# EAGLE design DAQAccel (EAGLE 9.6.0)
DOCUMENT_NUMBER: tbd; DOCUMENT_REVISION: ( ); RELEASE_DATE: tbd
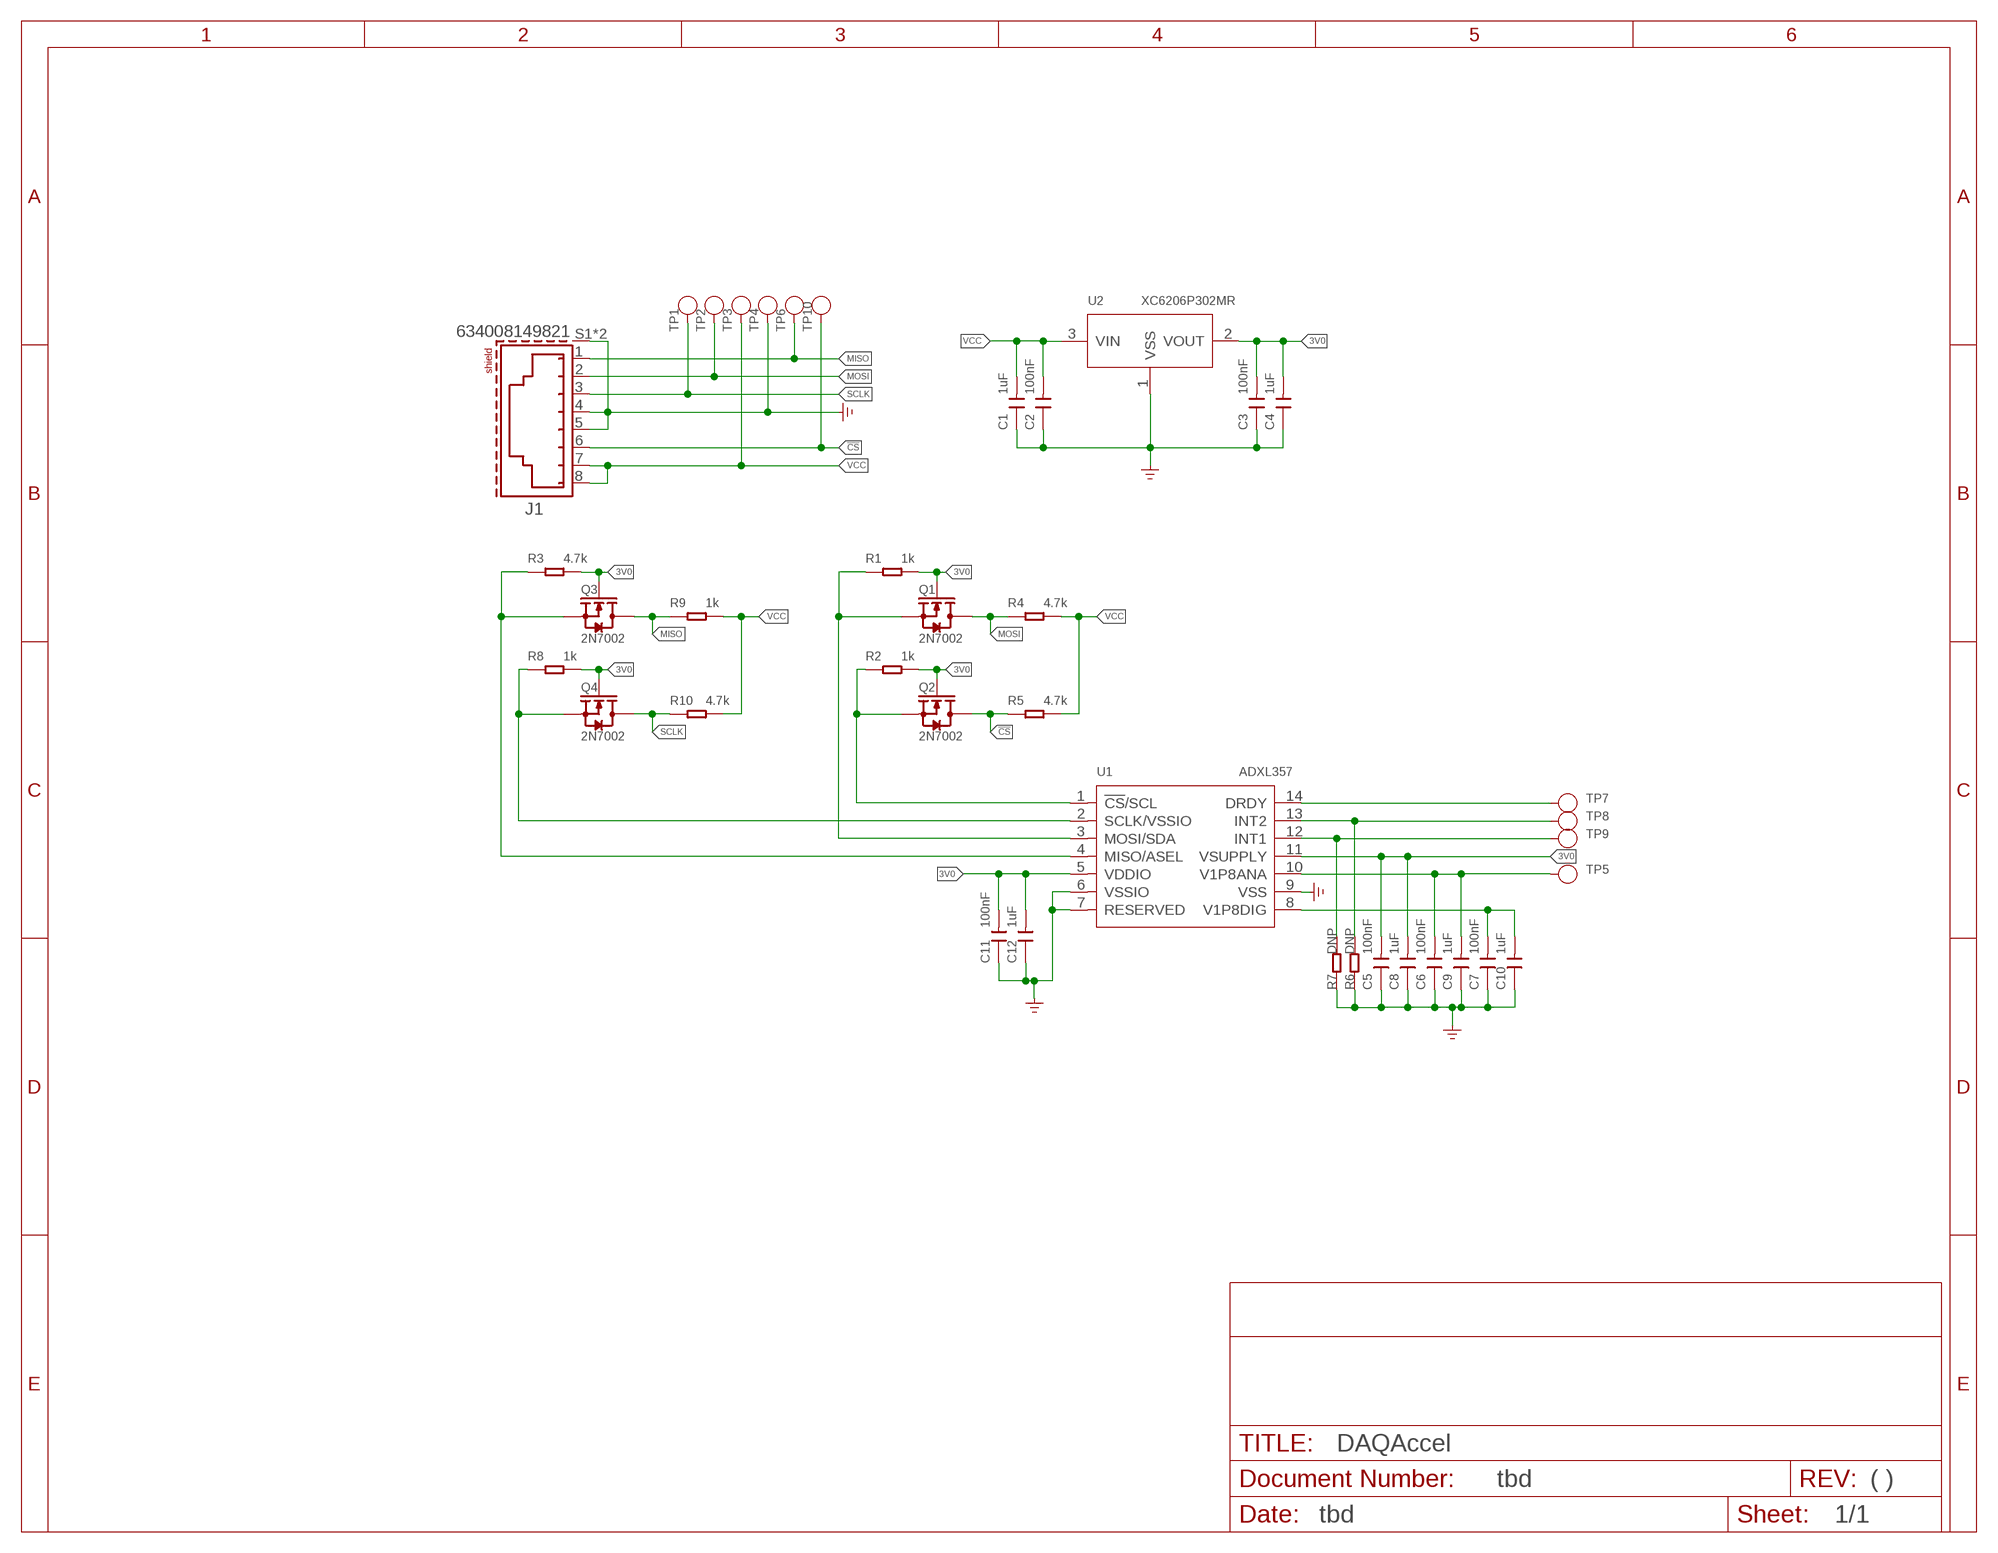
[diagram p0: schematic, sheet 1]

## Parts
C1  1uF  CAP-0603  [C0603]
C2  100nF  CAP-0603  [C0603]
C3  100nF  CAP-0603  [C0603]
C4  1uF  CAP-0603  [C0603]
C5  100nF  CAP-0603  [C0603]
C6  100nF  CAP-0603  [C0603]
C7  100nF  CAP-0603  [C0603]
C8  1uF  CAP-0603  [C0603]
C9  1uF  CAP-0603  [C0603]
C10  1uF  CAP-0603  [C0603]
C11  100nF  CAP-0603  [C0603]
C12  1uF  CAP-0603  [C0603]
J1  634008149821  [634008149821]
Q1  2N7002  MOSFET-N'SOT23'  [SOT-23]
Q2  2N7002  MOSFET-N'SOT23'  [SOT-23]
Q3  2N7002  MOSFET-N'SOT23'  [SOT-23]
Q4  2N7002  MOSFET-N'SOT23'  [SOT-23]
R1  1k  RES-0603  [R0603]
R2  1k  RES-0603  [R0603]
R3  4.7k  RES-0603  [R0603]
R4  4.7k  RES-0603  [R0603]
R5  4.7k  RES-0603  [R0603]
R6  DNP  RES-0603  [R0603]
R7  DNP  RES-0603  [R0603]
R8  1k  RES-0603  [R0603]
R9  1k  RES-0603  [R0603]
R10  4.7k  RES-0603  [R0603]
TP1  Test  TEST-POINT'4545'  [TP-D45MIL]
TP2  Test  TEST-POINT'4545'  [TP-D45MIL]
TP3  Test  TEST-POINT'4545'  [TP-D45MIL]
TP4  Test  TEST-POINT'4545'  [TP-D45MIL]
TP5  Test  TEST-POINT'4545'  [TP-D45MIL]
TP6  Test  TEST-POINT'4545'  [TP-D45MIL]
TP7  Test  TEST-POINT'4545'  [TP-D45MIL]
TP8  Test  TEST-POINT'4545'  [TP-D45MIL]
TP9  Test  TEST-POINT'4545'  [TP-D45MIL]
TP10  Test  TEST-POINT'4545'  [TP-D45MIL]
U1  ADXL357  SENSOR-ADXL357BEZ  [LCC-14-TERMINAL]
U2  XC6206P302MR  PMIC-XC6206PMR  [SOT-23]

## Nets
3V0: C3.2 C4.2 C5.2 C8.2 C11.2 C12.2 Q1.1(G) Q2.1(G) Q3.1(G) Q4.1(G) R1.2 R2.2 R3.2 R8.2 U1.5(VDDIO) U1.11(VSUPPLY) U2.2(VOUT)
!CS: J1.6 Q2.3(D) R5.1 TP10.T
GND: C1.1 C2.1 C3.1 C4.1 C5.1 C6.1 C7.1 C8.1 C9.1 C10.1 C11.1 C12.1 J1.4 J1.5 J1.S1(SHIELD) J1.S2(SHIELD) R6.1 R7.1 TP4.T U1.6(VSSIO) U1.7(RESERVED) U1.9(VSS) U2.1(VSS) ; supply symbol labelled GND_POWER
MISO: J1.1 Q3.3(D) R9.1 TP6.T
MOSI: J1.2 Q1.3(D) R4.1 TP2.T
N$1: Q2.2(S) R2.1 U1.1(!CS!/SCL)
N$2: TP7.T U1.14(DRDY)
N$3: Q1.2(S) R1.1 U1.3(MOSI/SDA)
N$4: R6.2 TP8.T U1.13(INT2)
N$5: C6.2 C9.2 TP5.T U1.10(V1P8ANA)
N$6: Q4.2(S) R8.1 U1.2(SCLK/VSSIO)
N$7: C7.2 C10.2 U1.8(V1P8DIG)
N$8: R7.2 TP9.T U1.12(INT1)
N$9: Q3.2(S) R3.1 U1.4(MISO/ASEL)
SCLK: J1.3 Q4.3(D) R10.1 TP1.T
VCC: C1.2 C2.2 J1.7 J1.8 R4.2 R5.2 R9.2 R10.2 TP3.T U2.3(VIN)

## Library data of the parts
C1-C12 = Discrete-new:CAP: Ceramic Capacitors
J1 = WR-MJ:634008149821: WR-MJ Modular Jack Horizontal Shielded SMT 8P8C Tab Up KIND PROPERTIES Quality Class:500 Mating cycles General Information Operating Temperature:-40 up to +85 °C Compliance:RoHS Electrical Properties IR1:1.5A Working Voltage:120V (AC) Withstanding Voltage:1000V (AC) Contact Resistance:20mΩ RISO:500 MΩ Material Properties Insulator MateriaL:PA9T Insulator Flammability Rating:UL94 V-0 Color:Black Cover Material Brass Cover Plating Nickel Contact Material Copper Alloy Contact Plating:Selective Gold Contact Type:Stamped Shielding Material:Brass Shielding Plating:Nickel Packaging Properties Packaging:Tray <https://www.we-online.com/catalog/media/o60696v209%20Family_WR-MJ_Horizontal_Shielded_634008149821_pf2.jpg> Details see: https://www.we-online.com/catalog/en/MJ_SMT_HORIZONTAL_SHIELDED_8P8C_TAB_UP/ Updated by Yingchun,Shan 2019-11-26 2019 (C) Würth Elektronik; DATASHEET-URL: https://www.we-online.com/catalog/datasheet/634008149821.pdf; MOUNT: SMT; PART-NUMBER: 634008149821; TYPE: Horizontal; XPXC: 8P8C
Q1-Q4 = Discrete-new:MOSFET-N: IRLL014: http://www.vishay.com/docs/91319/sihll014.pdf
R1-R10 = Discrete-new:RES
TP1-TP10 = Discrete-new:TEST-POINT; PARTNO: DNP
U1 = Sensor:SENSOR-ADXL357BEZ
U2 = IC-new:PMIC-XC6206P: LOW ESR Cap.Compatible Positive Voltage Regulators

## Board
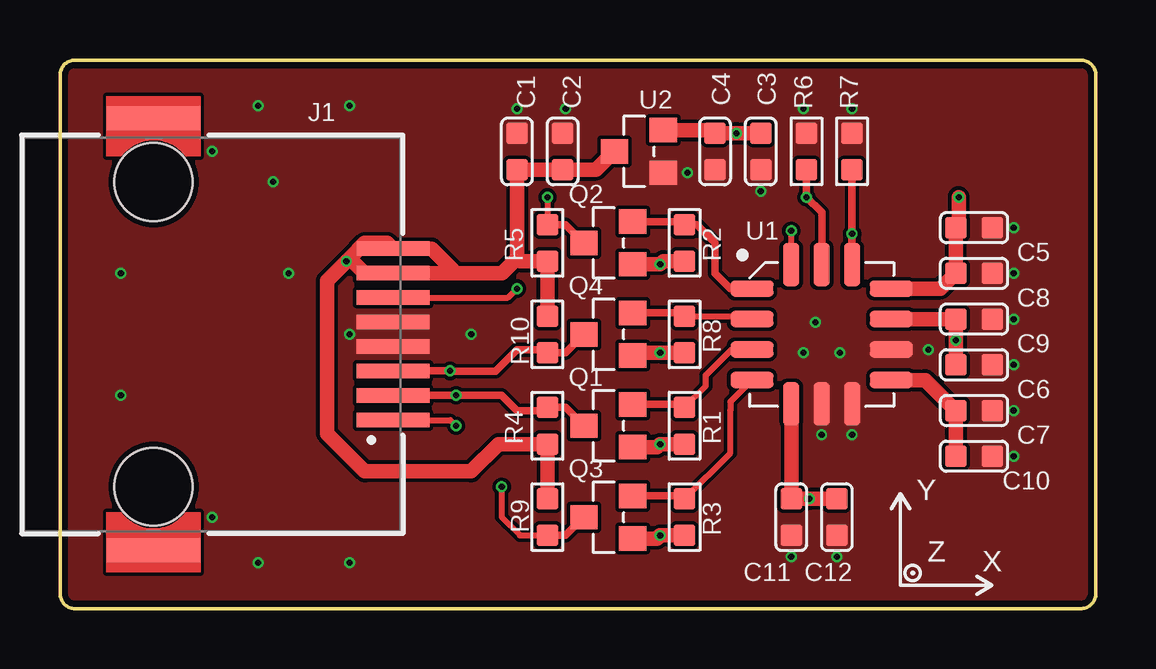
[diagram p1: board, top side]
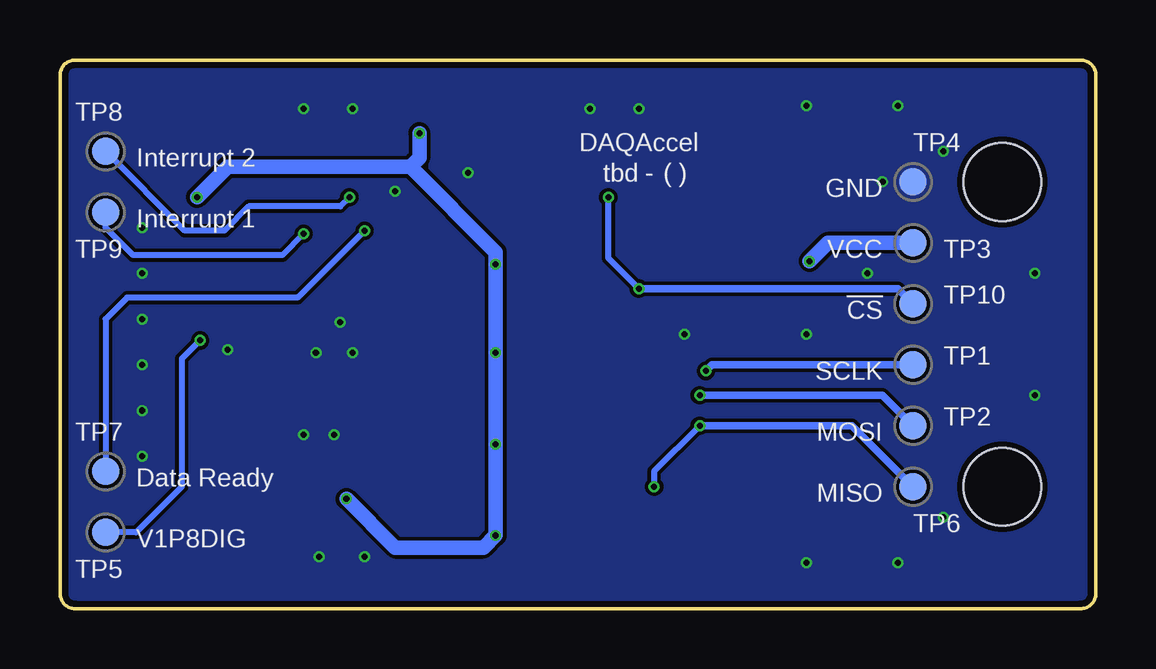
[diagram p2: board, bottom side, seen from below]

Size 43.18 x 22.86 mm. Coordinates in mm from the lower left corner, seen from the top.
Outline: 0.64,22.86 42.55,22.86 arc-90 43.18,22.23 43.18,0.63 arc-90 42.55,0 0.64,0 arc-90 0,0.63 0,22.23 arc-90 0.64,22.86
Copper layers (1*16): Top 0.035mm / dielectric 1.5mm / Bottom 0.035mm
Design rules "default *": minimum track width 1mil, minimum drill 10mil, track to track 6mil, track to pad 6mil, pad to pad 6mil, via to via 6mil, smd to smd 0mil, copper to edge 10mil, drill to drill 10mil, minimum pad ring 4mil, minimum via ring 4mil, stop-mask expansion 2mil, vias tented up to drill 25mil, thermal gap 10mil

### Footprints (pad centres in the part's own frame; a part is rotated, then mirrored left to right if it is on the bottom)
C0603 = smd 0.889 x 0.889: 1 -0.762,0; 2 0.762,0
634008149821 = smd 0.61 x 3.05: 1 3.57,7.53; 2 2.55,7.53; 3 1.53,7.53; 4 0.51,7.53; 5 -0.51,7.53; 6 -1.53,7.53; 7 -2.55,7.53; 8 -3.57,7.53 | smd 1 x 3.89: S1 -9,-2.45; S2 9,-2.45 | hole 3.25: -6.35,-2.45; 6.35,-2.45
SOT-23 = smd 1.143 x 1.016: 1 1.016,-0.889; 2 1.016,0.889; 3 -1.016,0
R0603 = smd 0.889 x 0.889: 1 -0.762,0; 2 0.762,0
TP-D45MIL = smd 1.143 x 1.143: T 0,0
LCC-14-TERMINAL = smd 0.68 x 1.8: 1 -1.905,-2.9; 2 -0.635,-2.9; 3 0.635,-2.9; 4 1.905,-2.9; 8 1.905,2.9; 9 0.635,2.9; 10 -0.635,2.9; 11 -1.905,2.9 | smd 1.8 x 0.68: 5 2.9,-1.27; 6 2.9,0; 7 2.9,1.27; 12 -2.9,1.27; 13 -2.9,0; 14 -2.9,-1.27
SOT-23' = smd 1.016 x 1.143: 1 -0.889,-1.016; 2 0.889,-1.016; 3 0,1.016

### Placement (x,y rotation side)
C1  19.05,19.05 270 top
C2  20.95,19.05 270 top
C3  29.21,19.05 90 top
C4  27.3,19.05 90 top
C5  38.1,15.88 180 top
C6  38.1,10.16 180 top
C7  38.1,8.25 180 top
C8  38.1,13.97 180 top
C9  38.1,12.06 180 top
C10  38.1,6.35 180 top
C11  30.48,3.81 90 top
C12  32.38,3.81 90 top
J1  6.35,11.43 270 top
Q1  22.86,7.62 0 top
Q2  22.86,15.24 0 top
Q3  22.86,3.81 0 top
Q4  22.86,11.43 0 top
R1  26.04,7.62 270 top
R2  26.04,15.24 270 top
R3  26.04,3.81 270 top
R4  20.32,7.62 270 top
R5  20.32,15.24 270 top
R6  31.12,19.05 270 top
R7  33.02,19.05 270 top
R8  26.04,11.43 270 top
R9  20.32,3.81 90 top
R10  20.32,11.43 90 top
TP1  7.62,10.16 0 bottom
TP2  7.62,7.62 0 bottom
TP3  7.62,15.24 0 bottom
TP4  7.62,17.78 0 bottom
TP5  41.27,3.17 0 bottom
TP6  7.62,5.08 0 bottom
TP7  41.27,5.71 0 bottom
TP8  41.27,19.05 0 bottom
TP9  41.27,16.51 0 bottom
TP10  7.62,12.7 0 bottom
U1  31.75,11.43 270 top
U2  XC6206P302MR  [SOT-23']  24.13,19.05 90 top

### Tracks (layer width: path | path; a pad name or v marks a point on that pad's centre or on a via)
3V0  (via drill 0.25)
  Top 0.61: U1.11 36.7,13.33 C8.2 C5.2 37.47,16 v37.47,17.14 | U1.5 C11.2 v31.24,4.57 C12.2 | U2.2 27.18,19.94 C4.2 v28.19,19.81 C3.2 | Q2.1 24,14.48 24.13,14.35 v25.02,14.35 25.15,14.48 R2.2 | Q4.1 24,10.67 v25.02,10.67 R8.2 | Q1.1 24.89,6.73 v25.02,6.86 R1.2 | Q3.1 24.89,2.92 v25.02,3.05 R3.2
  Bottom 0.61: v37.47,17.14 36.2,18.41 28.57,18.41 | 28.57,18.41 25.02,14.86 v25.02,14.35 v25.02,10.67 v25.02,6.86 v25.02,3.05 25.53,2.54 29.21,2.54 v31.24,4.57 | v28.19,19.81 28.19,18.8 28.57,18.41
!CS  (via drill 0.25)
  Top 0.254: J1.6 18.68,12.96 v19.05,13.33 | v20.32,17.14 R5.1
  Top 0.305: R5.1 21.08,16 Q2.3
  Bottom 0.254: v19.05,13.33 20.32,14.61 v20.32,17.14
  Bottom 0.305: TP10.T 8.25,13.33 v19.05,13.33
GND  (via drill 0.25)
  other vias: 36.2,10.79 39.75,15.88 39.75,13.97 39.75,12.06 39.75,10.16 39.75,8.25 39.75,6.35 12.06,11.43 31.75,7.24 33.02,7.24 30.48,2.16 32.38,2.16 26.16,18.16 29.21,17.4 8.25,20.95 12.06,20.95 6.35,19.05 2.54,13.97 2.54,8.89 6.35,3.81 8.25,1.9 12.06,1.9 9.53,13.97 19.05,20.83 21.08,20.83 30.99,20.83 33.02,20.83 8.89,17.78 17.14,11.43 31.5,11.94 30.99,10.67 32.51,10.67
  pour Bottom (no thermals): -0.64,23.49 43.81,23.49 43.81,-0.63 -0.64,-0.63
  pour Top (no thermals): -0.64,23.49 43.81,23.49 43.81,-0.63 -0.64,-0.63
MISO  (via drill 0.25)
  Top 0.254: J1.1 16.27,7.86 v16.51,7.62 | v18.41,5.08 18.41,3.81 19.18,3.05 R9.1
  Top 0.305: R9.1 21.08,3.05 Q3.3
  Bottom 0.254: v16.51,7.62 18.41,5.71 v18.41,5.08
  Bottom 0.305: TP6.T 10.16,7.62 v16.51,7.62
MOSI  (via drill 0.25)
  Top 0.305: Q1.3 21.08,8.38 R4.1 20.19,8.25 19.05,8.25 18.41,8.89 v16.51,8.89 J1.2
  Bottom 0.305: TP2.T 8.89,8.89 v16.51,8.89
N$1
  Top 0.305: Q2.2 25.91,16.13 R2.1 26.54,16 27.3,15.24 27.3,13.97 27.94,13.33 U1.1
N$2  (via drill 0.25)
  Top 0.254: U1.14 v30.48,15.75
  Bottom 0.254: v30.48,15.75 33.27,12.95 40.39,12.95 41.27,12.06 TP7.T
N$3
  Top 0.254: R1.1 26.92,9.27 26.92,9.73 27.99,10.79 U1.3
  Top 0.305: Q1.2 25.91,8.51 R1.1
N$4  (via drill 0.25)
  Top 0.305: R6.2 v31.12,17.14 31.75,16.51 U1.13
  Bottom 0.254: v31.12,17.14 31.5,16.76 35.31,16.76 36.32,15.75 37.97,15.75 TP8.T
N$5  (via drill 0.25)
  Top 0.61: U1.10 C9.2 v37.34,11.18 C6.2
  Bottom 0.254: v37.34,11.18 38.1,10.41 38.1,5.08 40,3.17 TP5.T
N$6
  Top 0.254: R8.1 28.72,12.19 U1.2
  Top 0.305: Q4.2 25.91,12.32 R8.1
N$7
  Top 0.61: U1.8 36.07,9.53 C7.2 37.34,7.37 C10.2
N$8  (via drill 0.25)
  Top 0.305: U1.12 v33.02,15.62 R7.2
  Bottom 0.254: v33.02,15.62 33.91,14.73 40.13,14.73 41.27,15.88 TP9.T
N$9
  Top 0.254: R3.1 27.94,6.48 27.94,7.62 27.94,8.25 27.94,8.62 U1.4
  Top 0.305: Q3.2 25.4,4.7 25.91,4.7 R3.1
SCLK  (via drill 0.25)
  Top 0.305: Q4.3 21.08,10.67 R10.1 20.19,10.79 19.05,10.79 18.16,9.9 v16.26,9.9 v16.26,9.91 J1.3
  Bottom 0.305: TP1.T 16,10.16 v16.26,9.91
VCC  (via drill 0.25)
  Top 0.61: U2.3 22.35,18.29 C2.2 C1.2 19.05,14.61 | 19.05,14.61 19.18,14.48 R5.2 R10.2 | 19.05,14.61 18.43,13.98 16.51,13.98 | 16.51,13.98 J1.7 12.69,13.98 12.06,14.61 | 16.51,13.98 15.49,15 J1.8 13.64,15.24 12.7,15.24 12.06,14.61 | R9.2 R4.2 18.29,6.86 17.14,5.71 12.7,5.71 11.12,7.29 11.12,13.66 v11.94,14.48 12.06,14.61
  Bottom 0.61: TP3.T 11.18,15.24 v11.94,14.48

### Text on the board
tNames: Y | Z | X
bNames: Interrupt 2 | GND | - | Interrupt 1 | VCC | !CS | SCLK | MOSI | Data Ready | MISO | V1P8DIG